# EAGLE design lvc-delay-line (EAGLE 9.4.1)
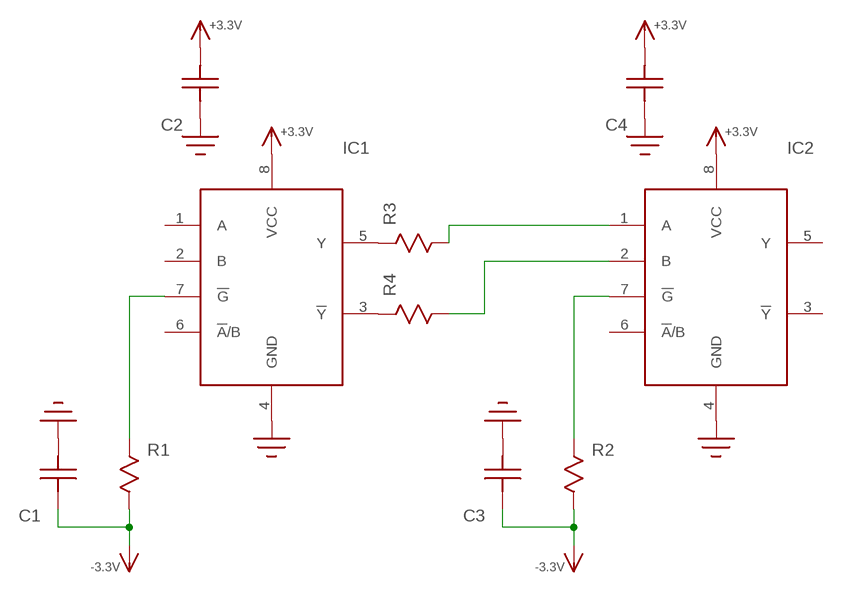
[diagram p0: schematic, sheet 1]

## Parts
C1  C0603  [C0603]
C2  C0603  [C0603]
C3  C0603  [C0603]
C4  C0603  [C0603]
IC1  74LVC2G157  [SSOP8]
IC2  74LVC2G157  [SSOP8]
R1  R0603  [R0603]
R2  R0603  [R0603]
R3  R0402  [0402]
R4  R0402  [0402]

## Nets
+3.3V: C2.P$1 C4.P$1 IC1.8(VCC) IC2.8(VCC)
-3.3V: C1.P$2 C3.P$2 R1.P$2 R2.P$2
GND: C1.P$1 C2.P$2 C3.P$1 C4.P$2 IC1.4(GND) IC2.4(GND)
N$1: IC1.7(!G!) R1.P$1
N$2: IC2.7(!G!) R2.P$1
N$3: IC2.1(A) R3.2
N$4: IC2.2(B) R4.2
N$5: IC1.5(Y) R3.1
N$6: IC1.3(!Y!) R4.1
Unconnected: IC1.1(A) IC1.2(B) IC1.6(!A!/B) IC2.3(!Y!) IC2.5(Y) IC2.6(!A!/B)

## Library data of the parts
C1-C4 = yapo:C
IC1 IC2 = yapo:74LVC2G157
R1-R4 = yapo:R

## Board
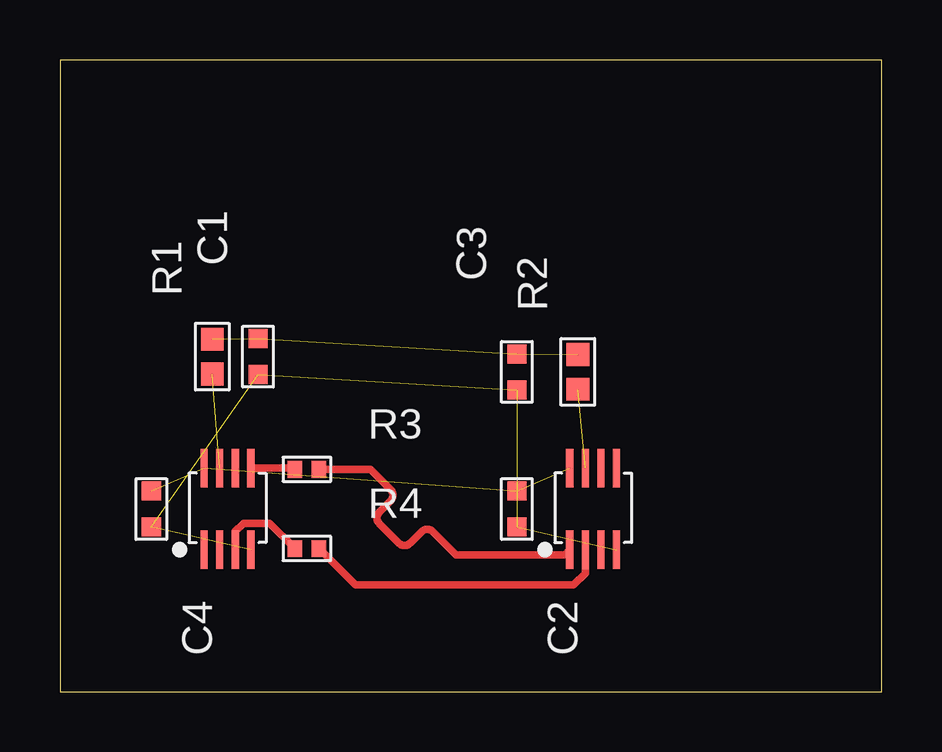
[diagram p1: board, top side]

Size 34.27 x 26.34 mm. Coordinates in mm from the lower left corner, seen from the top.
Outline: 0,0 34.27,0 34.27,26.34 0,26.34 0,0
Copper layers (1*16): Top 0.035mm / dielectric 1.5mm / Bottom 0.035mm
Design rules "default": minimum track width 6mil, minimum drill 0.35mm, track to track 6mil, track to pad 6mil, pad to pad 6mil, via to via 6mil, smd to smd 6mil, copper to edge 40mil, drill to drill 6mil, minimum pad ring 10mil, minimum via ring 8mil, stop-mask expansion 4mil, vias tented up to drill 0mil, thermal gap 10mil

### Footprints (pad centres in the part's own frame; a part is rotated, then mirrored left to right if it is on the bottom)
C0603 = smd 0.8 x 0.8: P$1 -0.75,0; P$2 0.75,0
SSOP8 = smd 0.3 x 1.6: 1 -0.975,-1.7; 2 -0.325,-1.7; 3 0.325,-1.7; 4 0.975,-1.7; 5 0.975,1.7; 6 0.325,1.7; 7 -0.325,1.7; 8 -0.975,1.7
R0603 = smd 0.95 x 0.95: P$1 -0.725,0; P$2 0.725,0
0402 = smd 0.6 x 0.7: 1 -0.5,0; 2 0.5,0

### Placement (x,y rotation side)
C1  8.26,13.97 90 top
C2  19.05,7.62 270 top
C3  19.05,13.34 90 top
C4  3.81,7.62 270 top
IC1  6.99,7.62 0 top
IC2  22.23,7.62 0 top
R1  6.35,13.97 90 top
R2  21.59,13.34 90 top
R3  10.29,9.27 0 top
R4  10.29,5.97 0 top

### Tracks (layer width: path | path; a pad name or v marks a point on that pad's centre or on a via)
+3.3V  (3 unrouted)
-3.3V  (3 unrouted)
GND  (5 unrouted)
N$1  (1 unrouted)
N$2  (1 unrouted)
N$3
  Top 0.305: R3.2 12.95,9.27 13.78,8.44 arc-90 13.78,7.96 13.31,7.49 arc90 13.31,7.01 14.12,6.2 arc90 14.61,6.2 15.07,6.67 arc-90 15.56,6.67 16.51,5.71 21.05,5.71 IC2.1
N$4
  Top 0.305: R4.2 12.32,4.45 21.41,4.45 21.9,4.93 IC2.2
N$5
  Top 0.305: IC1.5 9.75,9.32 R3.1
N$6
  Top 0.305: IC1.3 7.31,6.67 7.66,7.03 8.74,7.03 R4.1